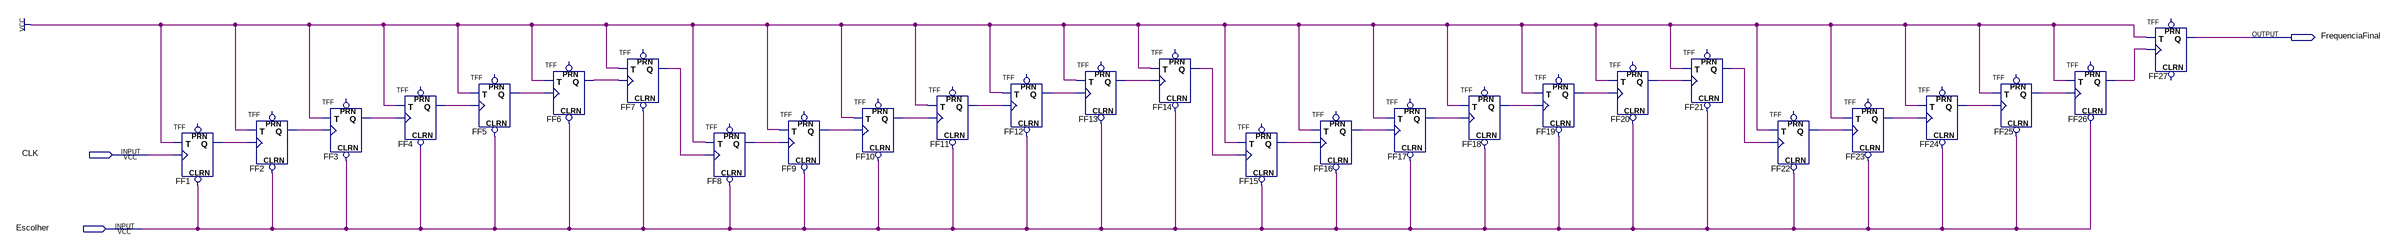
[diagram p0: schematic sheet]
// Quartus schematic DivisorFrequencia0.bdf as structural Verilog: 27 symbols, 3 pins
module DivisorFrequencia0 (
  input  CLK,
  input  Escolher,
  output FrequenciaFinal
);

  wire FF1_q, FF2_q, FF3_q, FF4_q, FF5_q, FF6_q, FF7_q, FF8_q, FF9_q, FF10_q, FF11_q, FF12_q, FF13_q, FF14_q,
       FF15_q, FF16_q, FF17_q, FF18_q, FF19_q, FF20_q, FF21_q, FF22_q, FF23_q, FF24_q, FF25_q, FF26_q;

  TFF FF1 (.CLRN(Escolher), .T(1'b1), .CLK(CLK), .Q(FF1_q));  // open: PRN
  TFF FF2 (.CLRN(Escolher), .T(1'b1), .CLK(FF1_q), .Q(FF2_q));  // open: PRN
  TFF FF3 (.CLRN(Escolher), .T(1'b1), .CLK(FF2_q), .Q(FF3_q));  // open: PRN
  TFF FF4 (.CLRN(Escolher), .T(1'b1), .CLK(FF3_q), .Q(FF4_q));  // open: PRN
  TFF FF5 (.CLRN(Escolher), .T(1'b1), .CLK(FF4_q), .Q(FF5_q));  // open: PRN
  TFF FF6 (.CLRN(Escolher), .T(1'b1), .CLK(FF5_q), .Q(FF6_q));  // open: PRN
  TFF FF7 (.CLRN(Escolher), .T(1'b1), .CLK(FF6_q), .Q(FF7_q));  // open: PRN
  TFF FF8 (.CLRN(Escolher), .T(1'b1), .CLK(FF7_q), .Q(FF8_q));  // open: PRN
  TFF FF9 (.CLRN(Escolher), .T(1'b1), .CLK(FF8_q), .Q(FF9_q));  // open: PRN
  TFF FF10 (.CLRN(Escolher), .T(1'b1), .CLK(FF9_q), .Q(FF10_q));  // open: PRN
  TFF FF11 (.CLRN(Escolher), .T(1'b1), .CLK(FF10_q), .Q(FF11_q));  // open: PRN
  TFF FF12 (.CLRN(Escolher), .T(1'b1), .CLK(FF11_q), .Q(FF12_q));  // open: PRN
  TFF FF13 (.CLRN(Escolher), .T(1'b1), .CLK(FF12_q), .Q(FF13_q));  // open: PRN
  TFF FF14 (.CLRN(Escolher), .T(1'b1), .CLK(FF13_q), .Q(FF14_q));  // open: PRN
  TFF FF15 (.CLRN(Escolher), .T(1'b1), .CLK(FF14_q), .Q(FF15_q));  // open: PRN
  TFF FF16 (.CLRN(Escolher), .T(1'b1), .CLK(FF15_q), .Q(FF16_q));  // open: PRN
  TFF FF17 (.CLRN(Escolher), .T(1'b1), .CLK(FF16_q), .Q(FF17_q));  // open: PRN
  TFF FF18 (.CLRN(Escolher), .T(1'b1), .CLK(FF17_q), .Q(FF18_q));  // open: PRN
  TFF FF19 (.CLRN(Escolher), .T(1'b1), .CLK(FF18_q), .Q(FF19_q));  // open: PRN
  TFF FF20 (.CLRN(Escolher), .T(1'b1), .CLK(FF19_q), .Q(FF20_q));  // open: PRN
  TFF FF21 (.CLRN(Escolher), .T(1'b1), .CLK(FF20_q), .Q(FF21_q));  // open: PRN
  TFF FF22 (.CLRN(Escolher), .T(1'b1), .CLK(FF21_q), .Q(FF22_q));  // open: PRN
  TFF FF23 (.CLRN(Escolher), .T(1'b1), .CLK(FF22_q), .Q(FF23_q));  // open: PRN
  TFF FF24 (.CLRN(Escolher), .T(1'b1), .CLK(FF23_q), .Q(FF24_q));  // open: PRN
  TFF FF25 (.CLRN(Escolher), .T(1'b1), .CLK(FF24_q), .Q(FF25_q));  // open: PRN
  TFF FF26 (.CLRN(Escolher), .T(1'b1), .CLK(FF25_q), .Q(FF26_q));  // open: PRN
  TFF FF27 (.T(1'b1), .CLK(FF26_q), .Q(FrequenciaFinal));  // open: PRN, CLRN
endmodule
